# EAGLE design i2cRelay (EAGLE 9.2.2)

## Sheet 1 of 2
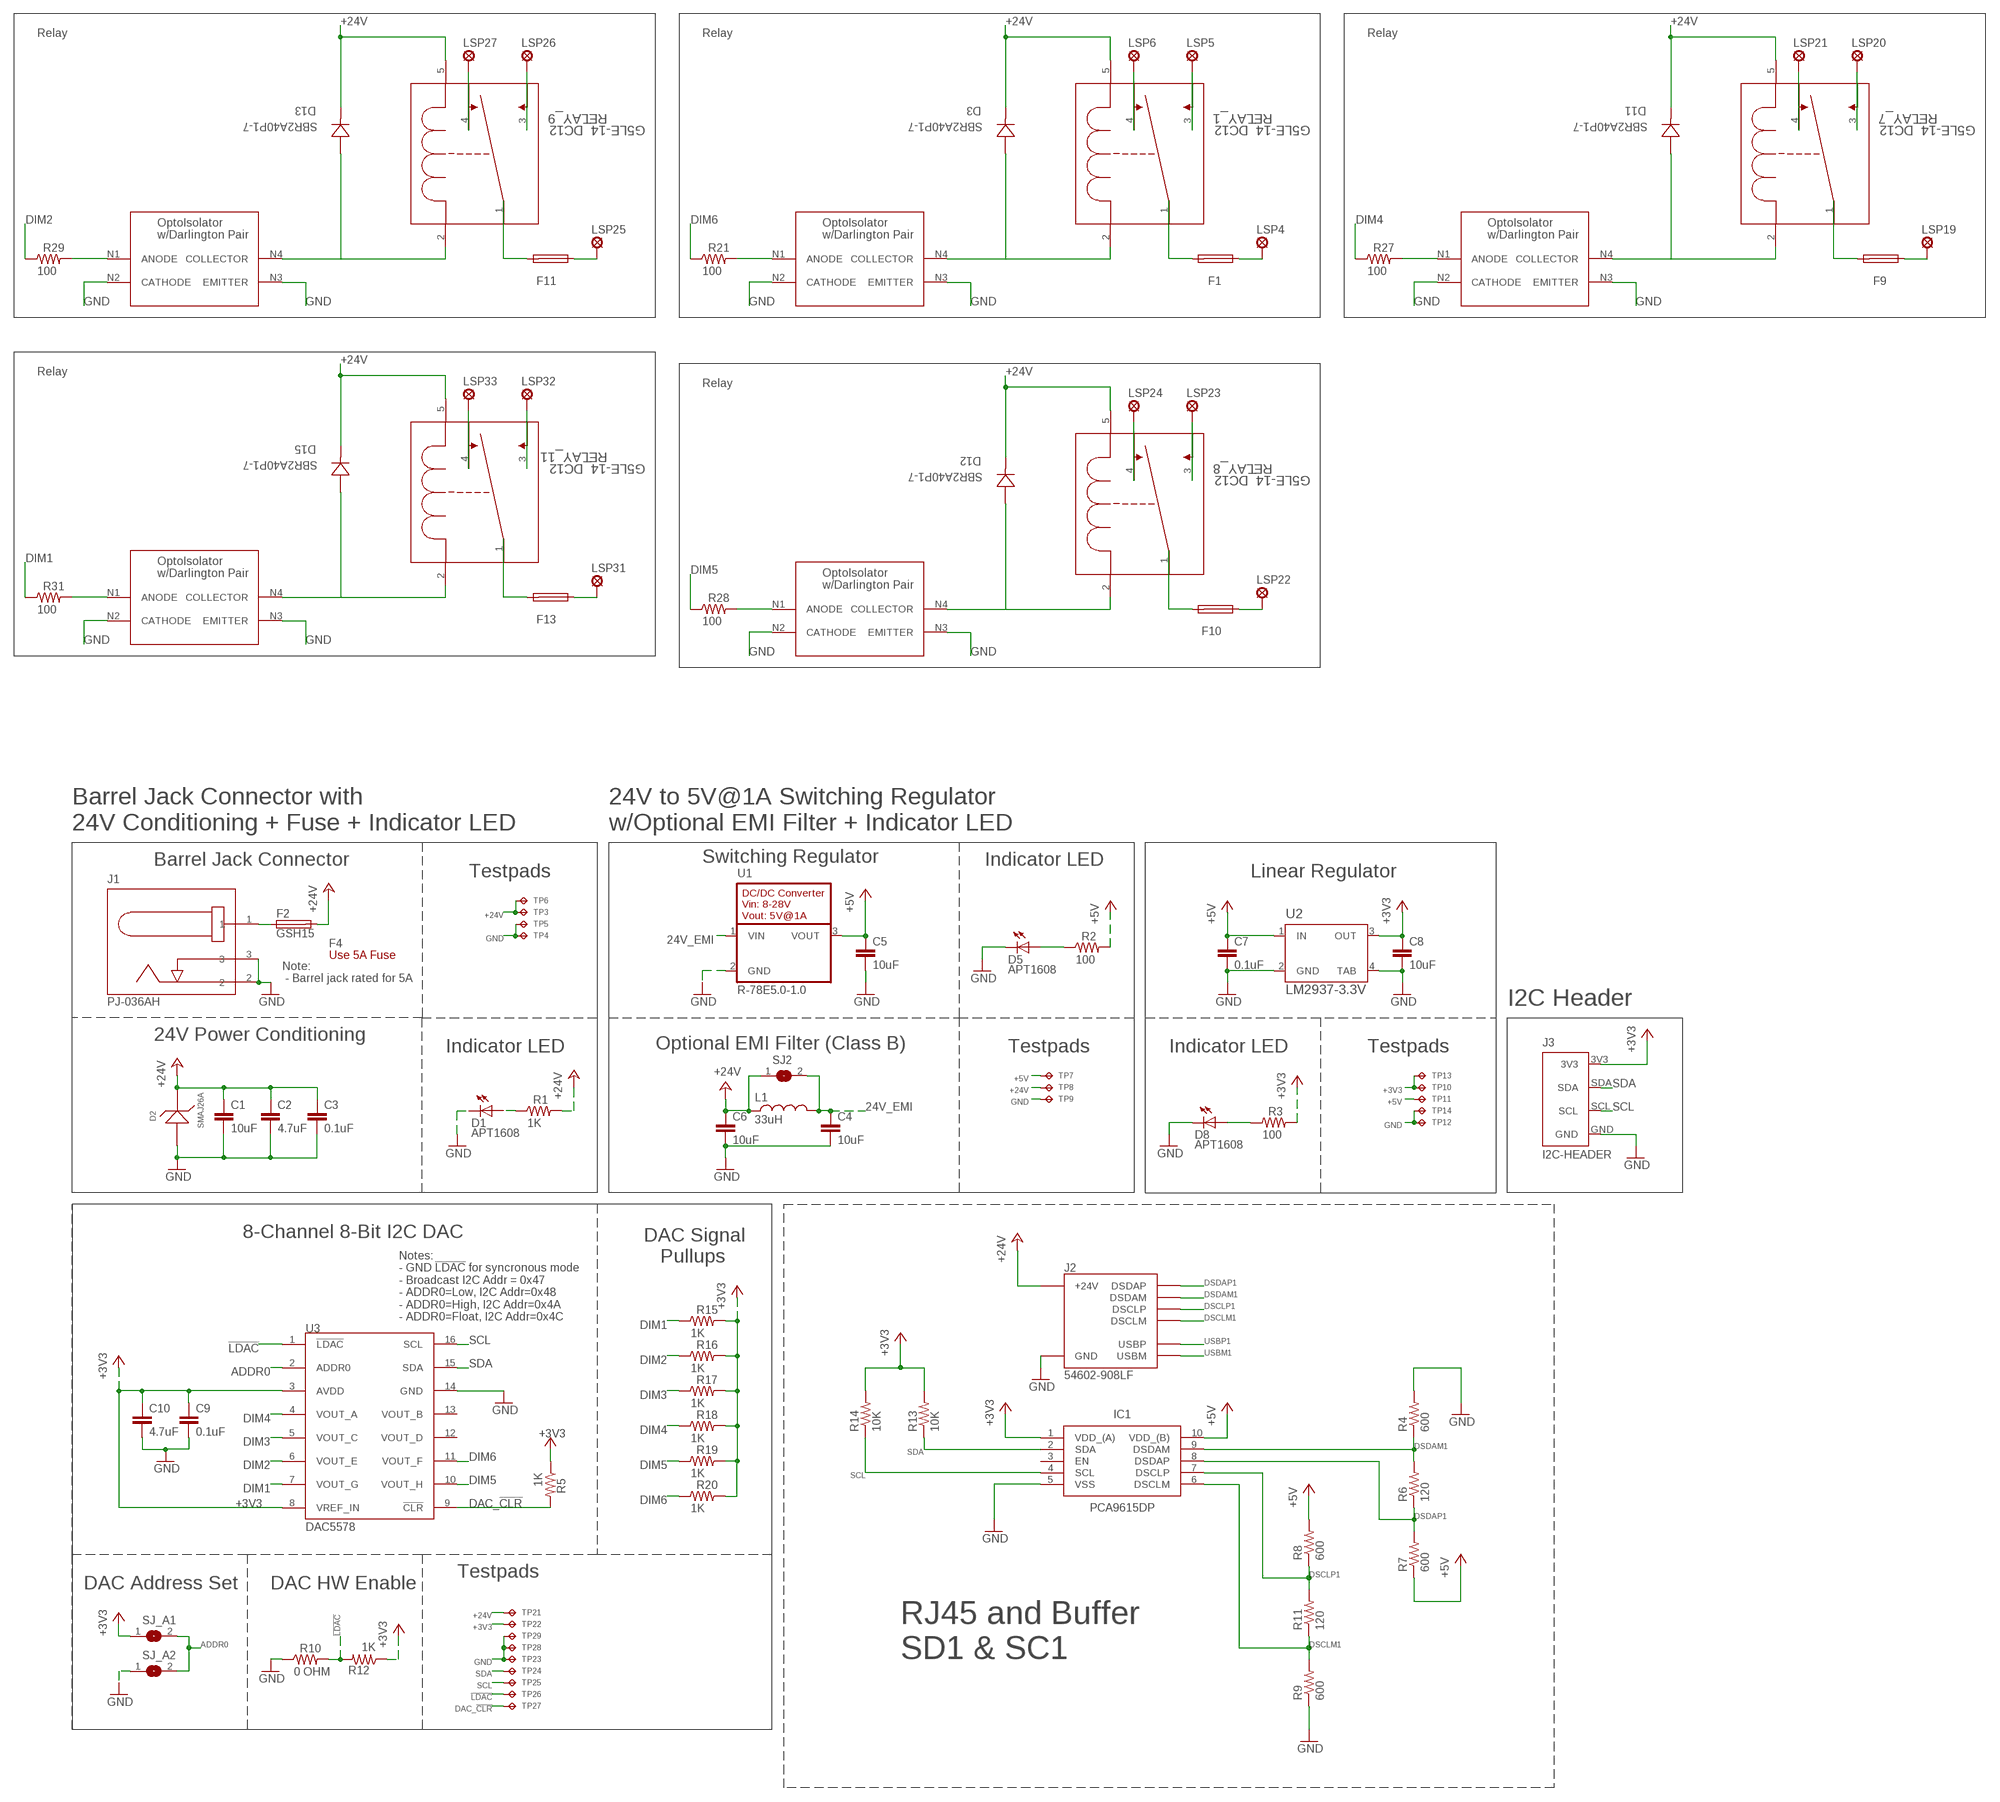
[diagram p0: schematic, sheet 1]

### Parts
C1  10uF  10UF-GMK212BBJ106KG-T  [C0805]
C2  4.7uF  4.7UF-CL21A475KBQNNNE  [C0805]
C3  0.1uF  0.1UF-C0603C104K5RACTU  [C0603]
C4  10uF  10UF-GMK212BBJ106KG-T  [C0805]
C5  10uF  10UF-GMK212BBJ106KG-T  [C0805]
C6  10uF  10UF-GMK212BBJ106KG-T  [C0805]
C7  0.1uF  0.1UF-C0603C104K5RACTU  [C0603]
C8  10uF  10UF-GMK212BBJ106KG-T  [C0805]
C9  0.1uF  0.1UF-C0603C104K5RACTU  [C0603]
C10  4.7uF  4.7UF-CL21A475KBQNNNE  [C0805]
D1  APT1608  APT1608CGCK  [CHIPLED_0603]
D2  SMAJ26A  SMAJ26A-13-F  [SMA]
D3  SBR2A40P1-7  [POWERDI123]
D5  APT1608  APT1608CGCK  [CHIPLED_0603]
D8  APT1608  APT1608CGCK  [CHIPLED_0603]
D11  SBR2A40P1-7  [POWERDI123]
D12  SBR2A40P1-7  [POWERDI123]
D13  SBR2A40P1-7  [POWERDI123]
D15  SBR2A40P1-7  [POWERDI123]
F1  GSH15  [GSH15]
F2  GSH15  [GSH15]
F4  Use 5A Fuse  0217005.MXP  [FUSE-CARTRIDGE]
F9  GSH15  [GSH15]
F10  GSH15  [GSH15]
F11  GSH15  [GSH15]
F13  GSH15  [GSH15]
IC1  PCA9615DP  [SOP50P490X110-10N]
J1  PJ-036AH  BARREL-JACK-PJ-036AH-SMT-TR  [BARREL-JACK-PJ-036AH]
J2  54602-908LF  OPENAG-V1-RJ45PTH  [OPENAG-V1-RJ45]
J3  I2C-HEADER  HEADER-I2C  [HEADER-I2C]
L1  33uH  33UH-29333C  [29333C]
LSP4  SE14  [SE14]
LSP5  SE14  [SE14]
LSP6  SE14  [SE14]
LSP19  SE14  [SE14]
LSP20  SE14  [SE14]
LSP21  SE14  [SE14]
LSP22  SE14  [SE14]
LSP23  SE14  [SE14]
LSP24  SE14  [SE14]
LSP25  SE14  [SE14]
LSP26  SE14  [SE14]
LSP27  SE14  [SE14]
LSP31  SE14  [SE14]
LSP32  SE14  [SE14]
LSP33  SE14  [SE14]
R1  1K  1K-ERJ-PB3D1001V  [RC0603N]
R2  100  100OHM-RC0603JR-07100RL  [RC0603N]
R3  100  100OHM-RC0603JR-07100RL  [RC0603N]
R4  600  R-US_R0603  [R0603]
R5  1K  1K-ERJ-PB3D1001V  [RC0603N]
R6  120  R-US_R0603  [R0603]
R7  600  R-US_R0603  [R0603]
R8  600  R-US_R0603  [R0603]
R9  600  R-US_R0603  [R0603]
R10  0 OHM  0OHM-RC0603JR-070RL  [RC0603N]
R11  120  R-US_R0603  [R0603]
R12  1K  1K-ERJ-PB3D1001V  [RC0603N]
R13  10K  R-US_R0603  [R0603]
R14  10K  R-US_R0603  [R0603]
R15  1K  1K-ERJ-PB3D1001V  [RC0603N]
R16  1K  1K-ERJ-PB3D1001V  [RC0603N]
R17  1K  1K-ERJ-PB3D1001V  [RC0603N]
R18  1K  1K-ERJ-PB3D1001V  [RC0603N]
R19  1K  1K-ERJ-PB3D1001V  [RC0603N]
R20  1K  1K-ERJ-PB3D1001V  [RC0603N]
R21  100  100OHM-RC0603JR-07100RL  [RC0603N]
R27  100  100OHM-RC0603JR-07100RL  [RC0603N]
R28  100  100OHM-RC0603JR-07100RL  [RC0603N]
R29  100  100OHM-RC0603JR-07100RL  [RC0603N]
R31  100  100OHM-RC0603JR-07100RL  [RC0603N]
RELAY_1  G5LE-14_DC12  [RELAY_G5LE-1]
RELAY_7  G5LE-14_DC12  [RELAY_G5LE-1]
RELAY_8  G5LE-14_DC12  [RELAY_G5LE-1]
RELAY_9  G5LE-14_DC12  [RELAY_G5LE-1]
RELAY_11  G5LE-14_DC12  [RELAY_G5LE-1]
SJ2  EMI-BYPASS  [EMI-BYPASS]
SJ_A1  SOLDERJUMPERREFLOW_NOPASTE  [SJ1]
SJ_A2  SOLDERJUMPERREFLOW_NOPASTE  [SJ1]
TP3  TPTP04R  [TP04R]
TP4  TPTP04R  [TP04R]
TP5  TPTP04R  [TP04R]
TP6  TPTP04R  [TP04R]
TP7  TPTP06R  [TP06R]
TP8  TPTP06R  [TP06R]
TP9  TPTP06R  [TP06R]
TP10  TPTP04R  [TP04R]
TP11  TPTP04R  [TP04R]
TP12  TPTP04R  [TP04R]
TP13  TPTP04R  [TP04R]
TP14  TPTP04R  [TP04R]
TP21  TPTP04R  [TP04R]
TP22  TPTP04R  [TP04R]
TP23  TPTP04R  [TP04R]
TP24  TPTP04R  [TP04R]
TP25  TPTP04R  [TP04R]
TP26  TPTP04R  [TP04R]
TP27  TPTP04R  [TP04R]
TP28  TPTP04R  [TP04R]
TP29  TPTP04R  [TP04R]
U1  R-78E5.0-1.0  [R-78E5.0-1.0]
U2  LM2937-3.3V  LM2937IMP-3.3/NOPB  [MP04A]
U3  DAC5578  DAC5578SPW  [TSSOP16]
U$3  LTV-355T  [LTV-355T]
U$8  LTV-355T  [LTV-355T]
U$9  LTV-355T  [LTV-355T]
U$10  LTV-355T  [LTV-355T]
U$12  LTV-355T  [LTV-355T]

### Nets
24V_EMI: C4.1 L1.2 SJ2.2 U1.1(VIN)
24V_IN1: F2.1 J1.1
!LDAC!: R10.2 R12.2 TP26.1(TP) U3.1(!LDAC!)
+3V3: C8.1 C9.1 C10.1 IC1.1(VDD_(A)) J3.3V3 R3.2 R5.1 R12.1 R13.2 R14.2 R15.2 R16.2 R17.2 R18.2 R19.2 R20.2 SJ_A1.1 TP10.1(TP) TP13.1(TP) TP22.1(TP) U2.3(OUT) U3.3(AVDD) U3.8(VREF_IN)
+5V: C5.1 C7.1 IC1.10(VDD_(B)) R2.2 R7.1 R8.2 TP7.TP TP11.1(TP) U1.3(VOUT) U2.1(IN)
+24V: C1.1 C2.1 C3.1 C6.1 D2.1 D3.- D11.- D12.- D13.- D15.- F2.2 J2.24V(6)(+24V) L1.1 R1.2 RELAY_1.5 RELAY_7.5 RELAY_8.5 RELAY_9.5 RELAY_11.5 SJ2.1 TP3.1(TP) TP6.1(TP) TP8.TP TP21.1(TP) ; also sheet 2
ADDR0: SJ_A1.2 SJ_A2.2 U3.2(ADDR0)
DAC_!CLR!: R5.2 TP27.1(TP) U3.9(!CLR!)
DIM1: R15.1 R31.1 U3.7(VOUT_G)
DIM2: R16.1 R29.1 U3.6(VOUT_E)
DIM3: R17.1 U3.5(VOUT_C) ; also sheet 2
DIM4: R18.1 R27.1 U3.4(VOUT_A)
DIM5: R19.1 R28.1 U3.10(VOUT_H)
DIM6: R20.1 R21.1 U3.11(VOUT_F)
DSCLM1: IC1.6(DSCLM) J2.DSCLM(5)(DSCLM) R9.2 R11.1
DSCLP1: IC1.7(DSCLP) J2.DSCLP(4)(DSCLP) R8.1 R11.2
DSDAM1: IC1.9(DSDAM) J2.DSDAM(2)(DSDAM) R4.1 R6.2
DSDAP1: IC1.8(DSDAP) J2.DSDAP(1)(DSDAP) R6.1 R7.2
GND: C1.2 C2.2 C3.2 C4.2 C5.2 C6.2 C7.2 C8.2 C9.2 C10.2 D1.C D2.2 D5.C D8.C IC1.5(VSS) J1.2 J1.3 J2.GND(3)(GND) J3.GND R4.2 R9.1 R10.1 SJ_A2.1 TP4.1(TP) TP5.1(TP) TP9.TP TP12.1(TP) TP14.1(TP) TP23.1(TP) TP28.1(TP) TP29.1(TP) U1.2(GND) U2.2(GND) U2.4(TAB) U3.14(GND) U$3.N2(CATHODE) U$3.N3(EMITTER) U$8.N2(CATHODE) U$8.N3(EMITTER) U$9.N2(CATHODE) U$9.N3(EMITTER) U$10.N2(CATHODE) U$10.N3(EMITTER) U$12.N2(CATHODE) U$12.N3(EMITTER) ; also sheet 2
N$1: D1.A R1.1
N$3: D5.A R2.1
N$5: D3.+ RELAY_1.2 U$3.N4(COLLECTOR)
N$6: D8.A R3.1
N$7: F1.2 RELAY_1.1
N$11: LSP5.MP RELAY_1.3
N$13: R21.2 U$3.N1(ANODE)
N$14: LSP6.MP RELAY_1.4
N$15: F1.1 LSP4.MP
N$40: D11.+ RELAY_7.2 U$8.N4(COLLECTOR)
N$41: F9.2 RELAY_7.1
N$42: LSP20.MP RELAY_7.3
N$43: R27.2 U$8.N1(ANODE)
N$44: LSP21.MP RELAY_7.4
N$45: F9.1 LSP19.MP
N$46: D12.+ RELAY_8.2 U$9.N4(COLLECTOR)
N$47: F10.2 RELAY_8.1
N$48: LSP23.MP RELAY_8.3
N$49: R28.2 U$9.N1(ANODE)
N$50: LSP24.MP RELAY_8.4
N$51: F10.1 LSP22.MP
N$52: D13.+ RELAY_9.2 U$10.N4(COLLECTOR)
N$53: F11.2 RELAY_9.1
N$54: LSP26.MP RELAY_9.3
N$55: R29.2 U$10.N1(ANODE)
N$56: LSP27.MP RELAY_9.4
N$57: F11.1 LSP25.MP
N$64: D15.+ RELAY_11.2 U$12.N4(COLLECTOR)
N$65: F13.2 RELAY_11.1
N$66: LSP32.MP RELAY_11.3
N$67: R31.2 U$12.N1(ANODE)
N$68: LSP33.MP RELAY_11.4
N$69: F13.1 LSP31.MP
SCL: IC1.4(SCL) J3.SCL R14.1 TP25.1(TP) U3.16(SCL)
SDA: IC1.2(SDA) J3.SDA R13.1 TP24.1(TP) U3.15(SDA)
USBM1: J2.USBM(8)(USBM)
USBP1: J2.USBP(7)(USBP)
Unconnected: IC1.3(EN) U3.12(VOUT_D) U3.13(VOUT_B)

### Notes on the sheet
- Relay | Relay | Relay
- Relay
- Relay
- Barrel Jack Connector with
  24V Conditioning + Fuse + Indicator LED
- 24V to 5V@1A Switching Regulator
  w/Optional EMI Filter + Indicator LED
- Barrel Jack Connector | Switching Regulator | Indicator LED
- Testpads | Linear Regulator
- Note:
   - Barrel jack rated for 5A
- I2C Header
- 24V Power Conditioning
- Indicator LED | Optional EMI Filter (Class B) | Testpads | Indicator LED | Testpads
- 8-Channel 8-Bit I2C DAC
- DAC Signal 
     Pullups
- Notes:
  - GND !LDAC! for syncronous mode
  - Broadcast I2C Addr = 0x47
  - ADDR0=Low, I2C Addr=0x48
  - ADDR0=High, I2C Addr=0x4A
  - ADDR0=Float, I2C Addr=0x4C
- Testpads
- DAC Address Set | DAC HW Enable
- RJ45 and Buffer
  SD1 & SC1

## Sheet 2 of 2
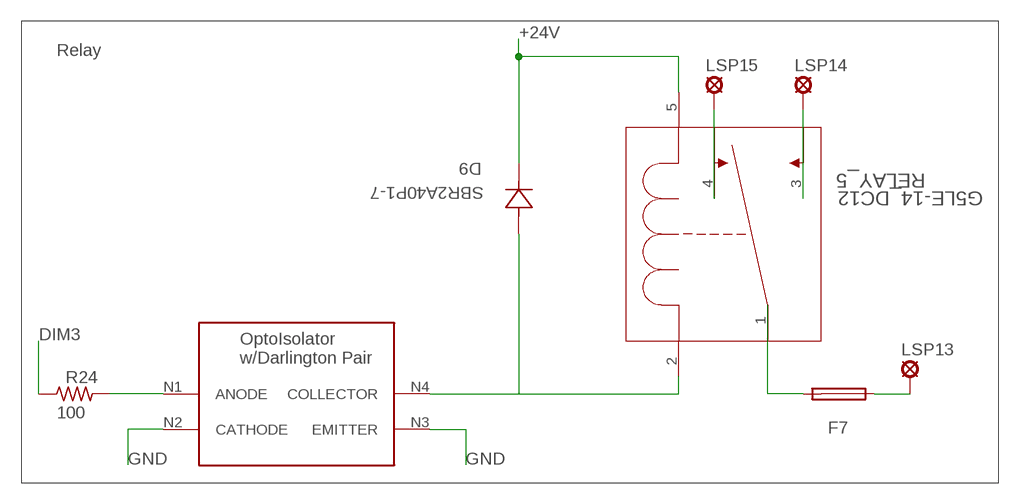
[diagram p1: schematic, sheet 2]

### Parts
D9  SBR2A40P1-7  [POWERDI123]
F7  GSH15  [GSH15]
LSP13  SE14  [SE14]
LSP14  SE14  [SE14]
LSP15  SE14  [SE14]
R24  100  100OHM-RC0603JR-07100RL  [RC0603N]
RELAY_5  G5LE-14_DC12  [RELAY_G5LE-1]
U$6  LTV-355T  [LTV-355T]

### Nets
+24V: D9.- RELAY_5.5 ; also sheet 1
DIM3: R24.1 ; also sheet 1
GND: U$6.N2(CATHODE) U$6.N3(EMITTER) ; also sheet 1
N$28: D9.+ RELAY_5.2 U$6.N4(COLLECTOR)
N$29: F7.2 RELAY_5.1
N$30: LSP14.MP RELAY_5.3
N$31: R24.2 U$6.N1(ANODE)
N$32: LSP15.MP RELAY_5.4
N$33: F7.1 LSP13.MP

### Notes on the sheet
- Relay

## Library data of the parts
C1 C4-C6 C8 = openag-capacitors:10UF-GMK212BBJ106KG-T: CAP CER 10UF 35V X5R 0805 Description: 10µF ±10% 35V Ceramic Capacitor X5R 0805 (2012 Metric) Technical Specifications: Capacitance: 10µF Tolerance: ±10% Rated Voltage: 35V Temperature Coefficient: X5R Operating Temperature: -55°C ~ 85°C Package / Case: 0805 (2012 Metric) Datasheet(s): GMK212BBJ106KG-T Spec <http://ds.yuden.co.jp/TYCOMPAS/ut/detail.do?productNo=GMK212BBJ106KG-T&fileName=GMK212BBJ106KG-T_SS&mode=specSheetDownload> Vendor(s): Digikey: 587-4893-1-ND <https://www.digikey.com/product-detail/en/taiyo-yuden/GMK212BBJ106KG-T/587-4893-1-ND/6563736>; MANUFACTURER: Taiyo Yuden; MPN: GMK212BBJ106KG-T; VENDOR: Digikey; VLINK: https://www.digikey.com/product-detail/en/taiyo-yuden/GMK212BBJ106KG-T/587-4893-1-ND/6563736; VPN: 587-4893-1-ND
C2 C10 = openag-capacitors:4.7UF-CL21A475KBQNNNE: CAP CER 4.7UF 50V X5R 0805 Description: 4.7µF ±10% 50V Ceramic Capacitor X5R 0805 (2012 Metric) Technical Specifications: Capacitance: 4.7uF Tolerance: ±10% Rated Voltage: 50V Temperature Coefficient: X5R Operating Temperature: -55°C ~ 85°C Package/Case: 0805 (2012 Metric) Datasheet(s): CL21A475KBQNNNE Characteristics <http://www.samsungsem.com/kr/front/downloadcms.do?path=/kr/support/product-search/mlcc/__icsFiles/afieldfile/2014/11/05&fileName=C_CL21A475KBQNNNE.pdf> Vendor(s): Digikey: 1276-1248-1-ND <https://www.digikey.com/product-detail/en/samsung-electro-mechanics/CL21A475KBQNNNE/1276-1248-1-ND/3889334>; MANUFACTURER: Samsung; MPN: CL21A475KBQNNNE; VENDOR: Digikey; VLINK: https://www.digikey.com/product-detail/en/samsung-electro-mechanics/CL21A475KBQNNNE/1276-1248-1-ND/3889334; VPN: 1276-1248-1-ND
C3 C7 C9 = openag-capacitors:0.1UF-C0603C104K5RACTU: CAP CER 0.1UF 50V X7R 0603 Description: 0.1µF ±10% 50V Ceramic Capacitor X7R 0603 (1608 Metric) Technical Specifications: Capacitance: 0.1µF Tolerance: ±10% Rated Voltage: 50V Temperature Coefficient: X7R Operating Temperature: -55°C ~ 125°C Package / Case: 0603 (1608 Metric) Datasheet(s): X7R Dielectric, 6.3-250 VDC <https://search.kemet.com/component-edge/download/datasheet/C0603C104K5RACTU.pdf> Vendor(s): Digikey: 399-5089-1-ND <https://www.digikey.com/product-detail/en/kemet/C0603C104K5RACTU/399-5089-1-ND/1465623>; MANUFACTURER: Kemet; MPN: C0603C104K5RACTU; VENDOR: Digikey; VLINK: https://www.digikey.com/product-detail/en/kemet/C0603C104K5RACTU/399-5089-1-ND/1465623; VPN: 399-5089-1-ND
D1 D5 D8 = openag-diodes:APT1608CGCK: LED GREEN CLEAR 0603 SMD Description: Green 570nm LED Indication - Discrete 2.1V 0603 (1608 Metric) Technical Specifications: Color: Green Lens Color: Colorless Lens Transparency: Clear Millicandela Rating: 50mcd Lens Style/Size: Rectangle with Flat Top, 1.20mm x 0.80mm Voltage - Forward (Vf) (Typ): 2.1V Current - Test: 20mA Viewing Angle: 120° Mounting Type: Surface Mount Wavelength - Dominant: 570nm Wavelength - Peak: 574nm Package / Case: 0603 (1608 Metric) Supplier Device Package: Chip LED Size / Dimension: 1.60mm L x 0.80mm W Height (Max): 0.75mm Datasheet(s): APT1608CGCK <http://www.kingbrightusa.com/images/catalog/SPEC/APT1608CGCK.pdf> Vendor(s): Digikey: 754-1116-1-ND <https://www.digikey.com/product-detail/en/kingbright/APT1608CGCK/754-1116-1-ND/1747833#>; MANUFACTURER: Kingbright; MPN: APT1608CGCK; VENDOR: Digikey; VLINK: https://www.digikey.com/product-detail/en/kingbright/APT1608CGCK/754-1116-1-ND/1747833#; VPN: 754-1116-1-ND
D2 = openag-diodes:SMAJ26A-13-F: TVS DIODE 26VWM 42.1VC SMA Description: TVS DIODE 26VWM 42.1VC SMA Technical Specifications: Type: Zener Voltage - Reverse Standoff (Typ): 26V Voltage - Breakdown (Min): 28.9V Voltage - Clamping (Max) @ Ipp: 42.1V Current - Peak Pulse (10/1000µs): 9.5A Power - Peak Pulse: 400W Power Line Protection: No Operating Temperature: -55°C ~ 150°C (TJ) DO-214AC, SMA Datasheet(s): SMAJ5.0(C)A - SMAJ200(C)A Vendor(s): Digikey: SMAJ26A-FDICT-ND <https://www.digikey.com/product-detail/en/diodes-incorporated/SMAJ26A-13-F/SMAJ26A-FDICT-ND/806583>; MANUFACTURER: Diodes Incorporated; MPN: SMAJ26A-13-F; VENDOR: Digikey; VLINK: https://www.digikey.com/product-detail/en/diodes-incorporated/SMAJ26A-13-F/SMAJ26A-FDICT-ND/806583; VPN: SMAJ26A-FDICT-ND
D3 D9 D11-D13 D15 = openag-diodes:SBR2A40P1-7: DIODE SBR 40V 2A POWERDI123 Description: Diode Super Barrier 40V 2A Surface Mount PowerDI™ 123 Technical Specifications: Diode Type: Super Barrier Voltage - DC Reverse (Vr) (Max): 40V Current - Average Rectified (Io): 2A Voltage - Forward (Vf) (Max) @ If: 500mV @ 2A Speed: Standard Recovery >500ns, > 200mA (Io) Current - Reverse Leakage @ Vr: 100µA @ 40V Mounting Type: Surface Mount Package / Case: POWERDI®123 Supplier Device Package: PowerDI™ 123 Operating Temperature - Junction: -65°C ~ 150°C Base Part Number: SBR2A40 Datasheet(s): SBR2A40P1 <https://www.diodes.com/assets/Datasheets/SBR2A40P1.pdf> Vendor(s): Digikey: SBR2A40P1DITR-ND <https://www.digikey.com/product-detail/en/diodes-incorporated/SBR2A40P1-7/SBR2A40P1DITR-ND/1681825>; MANUFACTURER: Diodes Incorporated; MPN: SBR2A40P1-7; VENDOR: Digikey; VLINK: https://www.digikey.com/product-detail/en/diodes-incorporated/SBR2A40P1-7/SBR2A40P1DITR-ND/1681825; VPN: SBR2A40P1DITR-ND
F1 F7 F9-F11 F13 = fuse:GSH15: FUSE HOLDER grid 15mm, 19649 Wickmann; MPN: 64900001039; OC_FARNELL: 1271673; OC_NEWARK: 02P0318
F2 = openag-fuses:GSH15: FUSE BLOCK CART 250V 6.3A PCB Description: Fuse Block 6.3A 250V 1 Circuit Cartridge PCB Technical Specifications: Fuseholder Type: Block Fuse Type: Cartridge For Use With/Related Products: 5mm x 20mm Fuse Size: 5mm x 20mm Number of Circuits: 1 Voltage: 250V Current Rating: 6.3A Mounting Type: PCB Orientation: Horizontal Termination Style: PC Pin Contact Material: Copper Alloy Contact Finish: Tin Datasheet(s): 649 Series <http://www.littelfuse.com/~/media/electronics/datasheets/fuse_blocks/littelfuse_fuse_block_649_datasheet.pdf.pdf> Vendor(s): Digikey: WK0011-ND <https://www.digikey.com/product-detail/en/littelfuse-inc/64900001039/WK0011-ND/245470>; MANUFACTURER: Littelfuse Inc.; MPN: 64900001039; VENDOR: Digikey; VLINK: https://www.digikey.com/product-detail/en/littelfuse-inc/64900001039/WK0011-ND/245470; VPN: WK0011-ND
F4 = openag-fuses:0217005.MXP: FUSE GLASS 5A 250VAC 5X20MM Description: FUSE GLASS 5A 250VAC 5X20MM Technical Specifications: Fuse Type: Cartridge, Glass Current Rating: 5A Voltage Rating - AC: 250V Response Time: Fast Package / Case: 5mm x 20mm Mounting Type: Holder Breaking Capacity @ Rated Voltage: 50A Melting I²t: 42.795 Approvals: BSI, CE, CCC, CSA, KC, PSE, SEMKO, UR, VDE Operating Temperature: -55°C ~ 125°C Size / Dimension: 0.205" Dia x 0.787" L (5.20mm x 20.00mm) DC Cold Resistance: 0.0137 Ohms Datasheet(s): 217 Series Datasheet <http://www.littelfuse.com/~/media/electronics/datasheets/fuses/littelfuse_fuse_217_datasheet.pdf.pdf> Vendor(s): Digikey: F1725-ND <https://www.digikey.com/product-detail/en/littelfuse-inc/0217005.MXP/F1725-ND/777549#>; MANUFACTURER: Littelfuse Inc.; MPN: 0217005.MXP; VENDOR: Digikey; VLINK: https://www.digikey.com/product-detail/en/littelfuse-inc/0217005.MXP/F1725-ND/777549; VPN: F1725-ND
IC1 = PCA9615DP:PCA9615DP: Buffer, ReDriver 2 Channel 400kHz 10-TSSOP Source: Datasheet <http://www.nxp.com/docs/en/data-sheet/PCA9615.pdf>; DESCRIPTION: Buffer, ReDriver 2 Channel 400kHz 10-TSSOP; HEIGHT: 1.1mm; MANUFACTURER_NAME: Nexperia; MANUFACTURER_PART_NUMBER: PCA9615DP; SUPPLIER_NAME: RS
J1 = openag-connectors:BARREL-JACK-PJ-036AH-SMT-TR: CONN PWR JACK 2X5.5MM SOLDER Description: Power Barrel Connector Jack 2.10mm ID (0.083"), 5.50mm OD (0.217") Surface Mount, Right Angle Technical Specifications: Connector Type: Jack Gender: Male Industry Recognized Mating Diameter: 2.10mm ID (0.083"), 5.50mm OD (0.217") Actual Diameter: 0.078" (2.00mm ID), 0.248" (6.30mm OD) Number of Positions/Contacts: 2 Conductors, 3 Contacts Internal Switch(s): Single Switch, Normally Closed Mounting Type: Surface Mount, Right Angle Termination: Solder Shielding: Unshielded Voltage - Rated: 24VDC Current Rating: 5A Mating Length/Depth: 0.360" (9.15mm) Contact Material - Plating: Silver Operating Temperature: -25°C ~ 85°C Housing Material: Polyamide (PA6T), Nylon 6T Contact Material: Brass; Copper Alloy Body Color: Black Datasheet(s): PJ-036AH-SMT-TR <http://www.cui.com/product/resource/digikeypdf/pj-036ah-smt-tr.pdf> Vendor(s): Digikey: CP-036AHPJCT-ND <https://www.digikey.com/product-detail/en/cui-inc/PJ-036AH-SMT-TR/CP-036AHPJCT-ND/1530994>; MANUFACTURER: CUI Inc.; MPN: PJ-036AH-SMT-TR; VENDOR: Digikey; VLINK: https://www.digikey.com/product-detail/en/cui-inc/PJ-036AH-SMT-TR/CP-036AHPJCT-ND/1530994; VPN: CP-036AHPJCT-ND
J2 = openag_connector:OPENAG-V1-RJ45: Amphenol FCI - 54602-908LF - CONN MOD JACK 8P8C R/A UNSHLD Description: Jack Modular Connector 8p8c (RJ45, Ethernet) 90� Angle (Right) Unshielded Cat3 Technical Specifications: Connector Type: Jack Number of Positions/Contacts: 8p8c (RJ45, Ethernet) Number of Ports: 1 Number of Rows: 1 Mounting Type: Through Hole Orientation: 90� Angle (Right) Termination: Solder Shielding: Unshielded Ratings: Cat3 Features: Board Lock LED Color: Does Not Contain LED Tab Direction: Down Contact Material: Copper Alloy Contact Finish: Gold Contact Finish Thickness: 15�in (0.38�m) Housing Material: Polyester, Glass Filled Operating Temperature: -40�C ~ 70�C Datasheet(s): 54601-x04(zzz)WPLF Drawing <http://cdn.amphenol-icc.com/media/wysiwyg/files/drawing/c-bmj-0102.pdf> Vendor(s): Digikey: 609-1046-ND <https://www.digikey.com/product-detail/en/amphenol-fci/54602-908LF/609-1046-ND/1001360>; POPULATE: YES; VERIFIED: NO
J3 = openag-connectors:HEADER-I2C: 100 MIL HEADER I2C CONNECTIONS; MPN: N/A
L1 = openag-inductors:33UH-29333C: FIXED IND 33UH 1A 120 MOHM SMD Description: 33µH Shielded Wirewound Inductor 1A 120 mOhm Max Nonstandard Technical Specifications: Type: Wirewound Inductance: 33µH Current Rating: 1A Shielding: Shielded DC Resistance (DCR): 120 mOhm Max Operating Temperature: -40°C ~ 85°C Frequency - Test: 10kHz Mounting Type: Surface Mount Package / Case: Nonstandard Size / Dimension: 0.283" L x 0.283" W (7.20mm x 7.20mm) Height - Seated (Max): 0.157" (4.00mm) Datasheet(s): 2900 Series <https://www.murata-ps.com/data/magnetics/kmp_2900.pdf> Vendor(s): Digikey: 811-1138-1-ND <https://www.digikey.com/product-detail/en/murata-power-solutions-inc/29333C/811-1138-1-ND/1924860>; MANUFACTURER: Murata Power Solutions Inc.; MPN: 29333C; VENDOR: Digikey; VLINK: https://www.digikey.com/product-detail/en/murata-power-solutions-inc/29333C/811-1138-1-ND/1924860; VPN: 811-1138-1-ND
LSP4-LSP6 LSP13-LSP15 LSP19-LSP27 LSP31-LSP33 = solpad:SE14: SOLDER PAD E1553, drill 1,4mm, distributor Buerklin, 07F820
R1 R5 R12 R15-R20 = openag-resistors:1K-ERJ-PB3D1001V: RES SMD 1K OHM 0.5% 1/5W 0603 Description: 1 kOhms ±0.5% 0.2W, 1/5W Chip Resistor 0603 (1608 Metric) Automotive AEC-Q200, Pulse Withstanding Thick Film Technical Specifications: Resistance: 1 kOhms Tolerance: ±0.5% Power: 0.2W, 1/5W Operating Temperature: -55°C ~ 155°C Package / Case: 0603 (1608 Metric) Datasheet(s): ERJ-PB3, PB6 Series, High Precision Datasheet <https://industrial.panasonic.com/cdbs/www-data/pdf/RDM0000/AOA0000C328.pdf> Vendor(s): Digikey: P20283CT-ND <https://www.digikey.com/product-detail/en/panasonic-electronic-components/ERJ-PB3D1001V/P20283CT-ND/6214538>; MANUFACTURER: Panasonic; MPN: P20283CT-ND; VENDOR: Digikey; VLINK: https://www.digikey.com/product-detail/en/panasonic-electronic-components/ERJ-PB3D1001V/P20283CT-ND/6214538; VPN: P20283CT-ND
R2 R3 R21 R24 R27-R29 R31 = openag-resistors:100OHM-RC0603JR-07100RL: RES SMD 100 OHM 5% 1/10W 0603 Description: 100 Ohms ±5% 0.1W, 1/10W Chip Resistor 0603 (1608 Metric) Moisture Resistant Thick Film Technical Specifications: Resistance: 100 Ohms Tolerance: ±5% Power (Watts): 0.1W, 1/10W Composition: Thick Film Features: Moisture Resistant Temperature Coefficient: ±100ppm/°C Operating Temperature: -55°C ~ 155°C Package / Case: 0603 (1608 Metric) Supplier Device Package: 0603 Size / Dimension: 0.063" L x 0.032" W (1.60mm x 0.80mm) Height - Seated (Max): 0.022" (0.55mm) Number of Terminations: 2 Datasheet(s): Thick Film Chip Resistor Intro <http://www.yageo.com.tw/exep/pages/download/literatures/PYu-R_INT-thick_7.pdf> Chip Resistor Marking <http://www.yageo.com/exep/pages/download/literatures/PYu-R_Marking_2.pdf> RC Series, L Datasheet <http://www.yageo.com/documents/recent/PYu-RC_Group_51_RoHS_L_8.pdf> Vendor(s): Digikey: 311-100GRCT-ND <https://www.digikey.com/product-detail/en/yageo/RC0603JR-07100RL/311-100GRCT-ND/729644>; MANUFACTURER: Yageo; MPN: RC0603JR-07100RL; VENDOR: Digikey; VLINK: https://www.digikey.com/product-detail/en/yageo/RC0603JR-07100RL/311-100GRCT-ND/729644; VPN: 311-100GRCT-ND
R4 R6-R9 R11 R13 R14 = rcl:R-US_: RESISTOR, American symbol
R10 = openag-resistors:0OHM-RC0603JR-070RL: RES SMD 0 OHM JUMPER 1/10W 0603 Description: 0 Ohms Jumper 0.1W, 1/10W Chip Resistor 0603 (1608 Metric) Moisture Resistant Thick Film Technical Specifications: Resistance: 0 Ohms Power: 0.1W, 1/10W Operating Temperature: -55°C ~ 155°C Package / Case: 0603 (1608 Metric) Datasheet(s): RC Series, L Datasheet <http://www.yageo.com/documents/recent/PYu-RC_Group_51_RoHS_L_8.pdf> Vendor(s): Digikey: 311-0.0GRCT-ND <https://www.digikey.com/product-detail/en/yageo/RC0603JR-070RL/311-0.0GRCT-ND/729622>; MANUFACTURER: Yageo; MPN: RC0603JR-070RL; VENDOR: Digikey; VLINK: https://www.digikey.com/product-detail/en/yageo/RC0603JR-070RL/311-0.0GRCT-ND/729622; VPN: 311-0.0GRCT-ND
RELAY_1 RELAY_5 RELAY_7-RELAY_9 RELAY_11 = relay_2:G5LE-14_DC12; MANUFACTURER_PART_NUMBER: G5LE14 DC12; VENDOR: OMRON
SJ2 = openag-connectors:EMI-BYPASS: EMI Bypass Solder Jumper; MPN: N/A
SJ_A1 SJ_A2 = openag-connectors:SOLDERJUMPER: SMD Solder JUMPER Solder the two pads together to create a connection, or remove the solder to break it. REFLOW - Use this footprint for solder paste and reflow ovens. WAVE - Use this footprint for hand-soldering (larger pads). CLOSED - Has a trace between the two pads to ensure it is closed by default. The trace needs to be cut to disable the jumper, and can be closed again by creating a solder bridge between the two pads.; MPN: N/A
TP3-TP14 TP21-TP29 = openag-testpads:TP: Test pad; MPN: N/A
U1 = openag-regulators:R-78E5.0-1.0: DC/DC CONVERTER 5V 5W Description: Linear Regulator Replacement DC DC Converter 1 Output 5V 1A 8V - 28V Input Technical Specifications: Type: Linear Regulator Replacement Number of Outputs: 1 Voltage - Input (Min): 8V Voltage - Input (Max): 28V Voltage - Output 1: 5V Current - Output (Max): 1A Power (Watts): 5W Applications: ITE (Commercial) Features: SCP Operating Temperature: -40°C ~ 85°C Efficiency: 91% Mounting Type: Through Hole Package / Case: 3-SIP Module Size / Dimension: 0.46" L x 0.33" W x 0.41" H (11.6mm x 8.5mm x 10.4mm) Datasheet(s): R-78E-1.0 Series Datasheet <https://www.recom-power.com/pdf/Innoline/R-78Exx-1.0.pdf> Vendor(s): Digikey: 945-2201-ND <https://www.digikey.com/product-detail/en/recom-power/R-78E5.0-1.0/945-2201-ND/4930585>; MANUFACTURER: Recom Power; MPN: R-78E5.0-1.0; VENDOR: Digikey; VLINK: https://www.digikey.com/product-detail/en/recom-power/R-78E5.0-1.0/945-2201-ND/4930585; VPN: 945-2201-ND
U2 = openag-regulators:LM2937IMP-3.3/NOPB: IC REG LIN 3.3V 400MA SOT223-4 Description: Linear Voltage Regulator IC Positive Fixed 1 Output 3.3V 400mA SOT-223-4 Technical Specifications: Output Configuration: Positive Output Type: Fixed Number of Regulators: 1 Voltage - Input (Max): 26V Voltage - Output (Min/Fixed): 3.3V Voltage Dropout (Max): 1V @ 50mA Current - Output: 400mA Current - Quiescent (Iq): 2mA Current - Supply (Max): 1.25A Protection Features: Over Temperature, Reverse Polarity, Short Circuit Operating Temperature: -40°C ~ 85°C Mounting Type: Surface Mount Package / Case: TO-261-4, TO-261AA Supplier Device Package: SOT-223-4 Base Part Number: LM2937 Datasheet(s): LM2937-2.5, LM2937-3.3 Datasheet <http://www.ti.com/lit/ds/symlink/lm2937-2.5.pdf> Vendor(s): Digikey: LM2937IMP-3.3/NOPBCT-ND <https://www.digikey.com/product-detail/en/texas-instruments/LM2937IMP-3.3-NOPB/LM2937IMP-3.3-NOPBCT-ND/270742#>; MANUFACTURER: Texas Instruments; MPN: LM2937IMP-3.3/NOPB; VENDOR: Digikey; VLINK: https://www.digikey.com/product-detail/en/texas-instruments/LM2937IMP-3.3-NOPB/LM2937IMP-3.3-NOPBCT-ND/270742#; VPN: LM2937IMP-3.3/NOPBCT-ND
U3 = openag-dacs:DAC5578SPW: IC DAC 8BIT I2C OCTAL 16TSSOP Description: 8 Bit Digital to Analog Converter 8 16-TSSOP Technical Specifications: Number of Bits: 8 Number of D/A Converters: 8 Settling Time: 12µs (Typ) Output Type: Voltage - Buffered Differential Output: No Data Interface: I²C Reference Type: External Voltage - Supply, Analog: 2.7 V ~ 5.5 V Voltage - Supply, Digital: 2.7 V ~ 5.5 V INL/DNL (LSB): ±0.01, ±0.01 Architecture: String DAC Operating Temperature: -40°C ~ 125°C Package / Case: 16-TSSOP (0.173", 4.40mm Width) Supplier Device Package: 16-TSSOP Base Part Number: DAC5578 Datasheet(s): DAC5578,6578,7578 <http://www.ti.com/lit/ds/symlink/dac5578.pdf> Analog Signal Chain Guide <http://www.ti.com/lit/pdf/slyb174> Vendor(s): Digikey: 296-27736-5-ND <https://www.digikey.com/product-detail/en/texas-instruments/DAC5578SPW/296-27736-5-ND/2360827>; MANUFACTURER: Texas Instruments; MPN: DAC5578SPW; VENDOR: Digikey; VLINK: https://www.digikey.com/product-detail/en/texas-instruments/DAC5578SPW/296-27736-5-ND/2360827; VPN: 296-27736-5-ND
U$3 U$6 U$8-U$10 U$12 = openag-transistors:LTV-355T

## Board
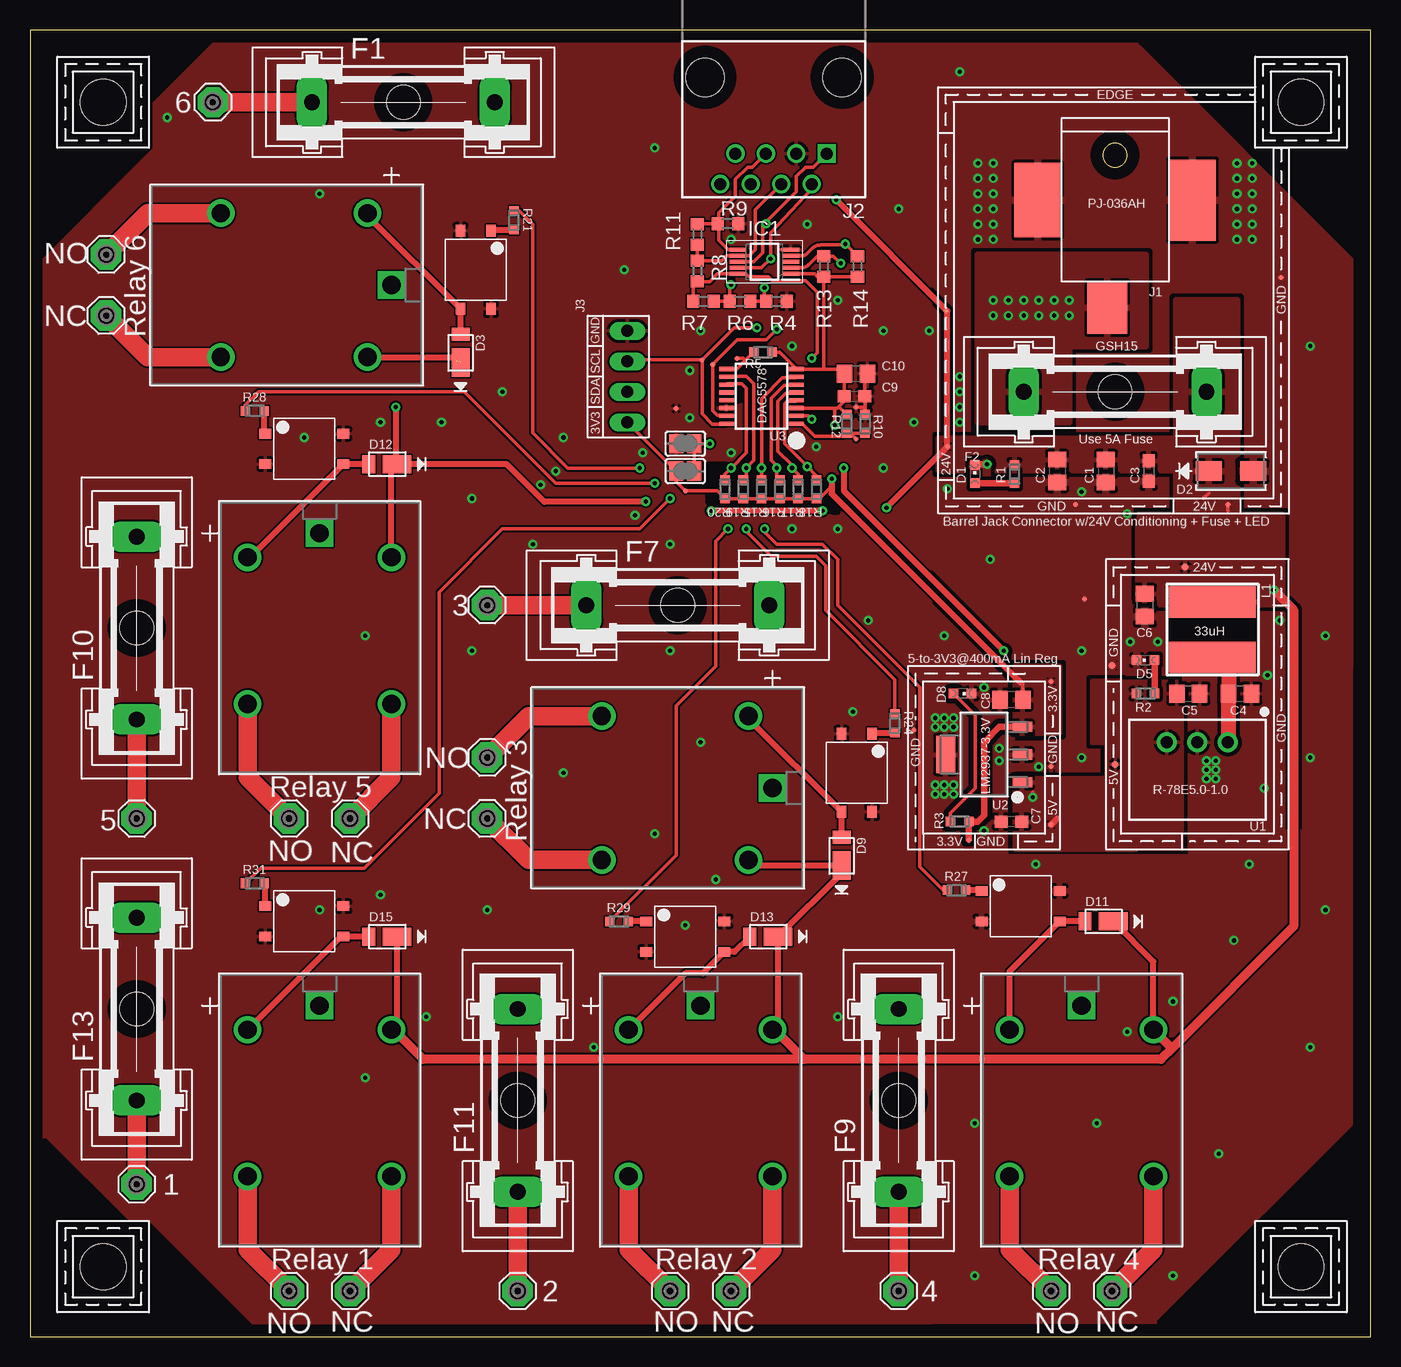
[diagram p2: board, top side]
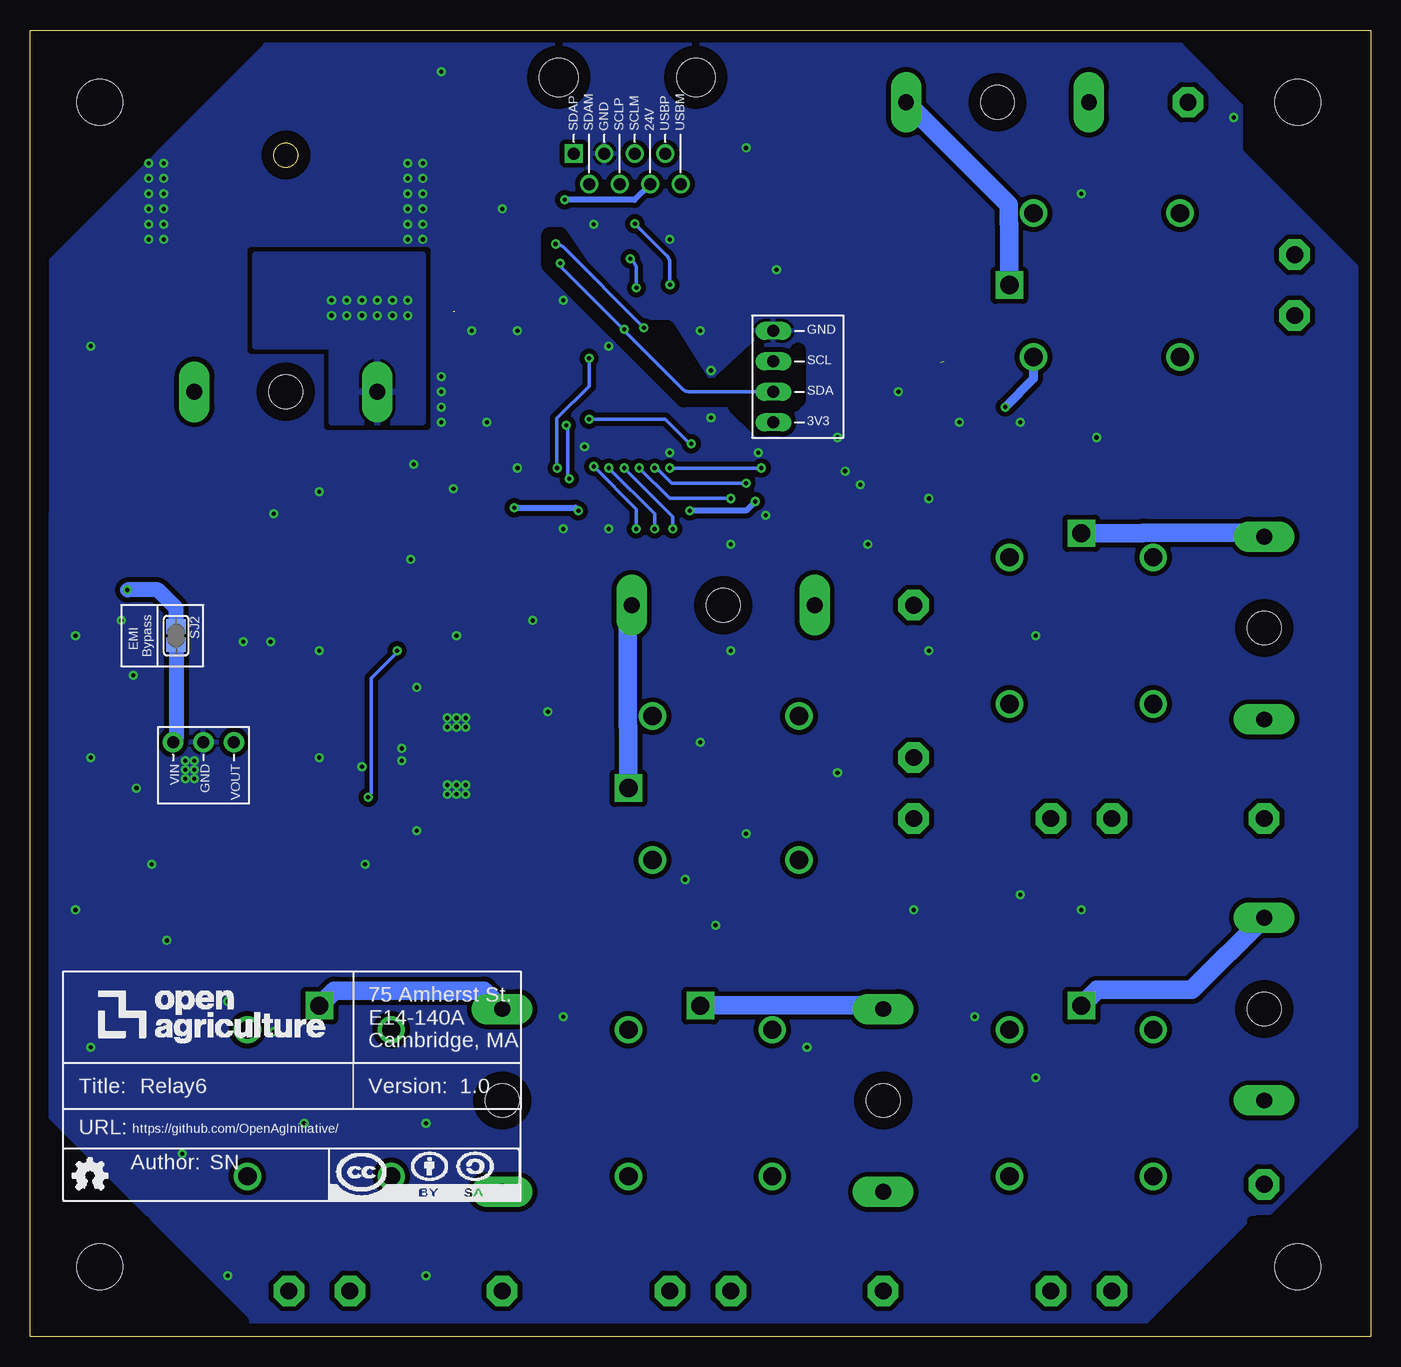
[diagram p3: board, bottom side, seen from below]

Size 111.74 x 108.89 mm. Coordinates in mm from the lower left corner, seen from the top.
Outline: 0,0 111.74,0 111.74,108.89 0,108.89 0,0
Copper layers (1*16): Top 0.035mm / dielectric 1.5mm / Bottom 0.035mm
Design rules "default": minimum track width 6mil, minimum drill 0.35mm, track to track 6mil, track to pad 6mil, pad to pad 6mil, via to via 6mil, smd to smd 6mil, copper to edge 40mil, drill to drill 6mil, minimum pad ring 10mil, minimum via ring 8mil, stop-mask expansion 4mil, vias tented up to drill 0mil, thermal gap 10mil
tRestrict: 16 lines
bRestrict: 23 lines

### Footprints (pad centres in the part's own frame; a part is rotated, then mirrored left to right if it is on the bottom)
C0805 = smd 1.3 x 1.5: 1 -0.95,0; 2 0.95,0
C0603 = smd 1.1 x 1: 1 -0.85,0; 2 0.85,0
CHIPLED_0603 = smd 0.8 x 0.8: A 0,-0.75; C 0,0.75
SMA = smd 2.18 x 1.63: 1 -1.857,0; 2 1.857,0
POWERDI123 = smd 1.05 x 1.5: + -1.3,0 | smd 2.4 x 1.5: - 1.05,0
GSH15 = drill 1.321 pad 2.54 long: 1 -7.62,0; 2 7.62,0 | hole 2.794: 0,0
SOP50P490X110-10N = smd 1.4 x 0.3: 1 -2.2,1; 2 -2.2,0.5; 3 -2.2,0; 4 -2.2,-0.5; 5 -2.2,-1; 6 2.2,-1; 7 2.2,-0.5; 8 2.2,0; 9 2.2,0.5; 10 2.2,1
BARREL-JACK-PJ-036AH = smd 4.4 x 3.3: 1 2.2,-0.65 | smd 6.75 x 3.9: 2 -6.75,6.45 | smd 6.2 x 3.9: 3 -6.75,-6.45
OPENAG-V1-RJ45 = drill 1: 24V(6) 1.905,8.89; DSCLM(5) 0.635,6.35; DSCLP(4) -0.635,8.89; DSDAM(2) -3.175,8.89; GND(3) -1.905,6.35; USBM(8) 4.445,8.89; USBP(7) 3.175,6.35 | drill 1 square: DSDAP(1) -4.445,6.35 | hole 3.2: -5.715,0; 5.715,0
HEADER-I2C = drill 1 long: 3V3 3.81,0.762; GND -3.81,0.762; SCL -1.27,0.762; SDA 1.27,0.762
29333C = smd 2.6 x 7.2: 1 -2.3,0; 2 2.3,0
SE14 = drill 1.397 pad 2.54 octagon: MP 0,0
RC0603N = smd 0.756 x 0.8: 1 -0.778,0; 2 0.778,0
R0603 = smd 1 x 1.1: 1 -0.85,0; 2 0.85,0
RELAY_G5LE-1 = drill 1.524 pad 2.032 square: 1 0,17.424 | drill 1.524 pad 2.032: 2 -5.994,15.418; 3 -5.994,3.2; 4 5.994,3.2; 5 5.994,15.418
EMI-BYPASS = smd 1.168 x 1.6: 1 -0.762,0.254; 2 0.762,0.254
SJ1 = smd 1.168 x 1.6: 1 -0.762,0; 2 0.762,0
TP04R = smd 0.4 x 0.4: 1 0,0
TP06R = smd 0.6 x 0.6: TP 0,0
R-78E5.0-1.0 = drill 1 pad 1.676: 1 -2.54,0; 2 0,0; 3 2.54,0
MP04A = smd 1.6 x 0.838: 1 -3.2,2.3; 2 -3.2,0; 3 -3.2,-2.3 | smd 1.6 x 3.099: 4 3.2,0
TSSOP16 = smd 0.35 x 1.2: 1 -2.275,-2.925; 2 -1.625,-2.925; 3 -0.975,-2.925; 4 -0.325,-2.925; 5 0.325,-2.925; 6 0.975,-2.925; 7 1.625,-2.925; 8 2.275,-2.925; 9 2.275,2.925; 10 1.625,2.925; 11 0.975,2.925; 12 0.325,2.925; 13 -0.325,2.925; 14 -0.975,2.925; 15 -1.625,2.925; 16 -2.275,2.925
CORNER = hole 3.81: 0,0
LTV-355T = smd 0.8 x 1: N1 -1.27,-3.25; N2 1.27,-3.25; N3 -1.27,3.25; N4 1.27,3.25

### Placement (x,y rotation side)
ATTRIBUTES  [DOCFIELD]  108.95,11.32 0 bottom
C1  89.66,72.14 270 top
C2  85.6,72.14 270 top
C3  93.22,72.14 270 top
C4  100.84,53.59 0 top
C5  96.52,53.59 0 top
C6  92.9,60.96 270 top
C7  81.79,42.93 180 top
C8  81.79,53.09 180 top
C9  68.71,78.36 0 top
C10  68.83,80.26 0 top
D1  78.74,71.88 0 top
D2  100.08,72.14 0 top
D3  35.88,82.23 270 top
D5  92.96,56.39 90 top
D8  77.72,53.59 270 top
D9  67.63,40.32 270 top
D11  89.22,34.61 0 top
D12  29.53,72.71 0 top
D13  61.28,33.34 0 top
D15  29.53,33.34 0 top
F1  31.12,102.87 0 top
F2  90.42,78.74 0 top
F4  87.38,74.42 0 top
F7  53.98,60.96 0 top
F9  72.39,19.69 90 top
F10  8.89,59.05 90 top
F11  40.64,19.69 90 top
F13  8.89,27.3 90 top
IC1  61.2,89.58 180 top
J1  90.42,87.96 270 top
J2  61.97,104.95 180 top
J3  49.02,80.01 270 top
L1  98.55,58.93 270 top
LSP4  15.24,102.87 270 top
LSP5  6.35,90.17 270 top
LSP6  6.35,85.09 270 top
LSP13  38.1,60.96 270 top
LSP14  38.1,48.26 270 top
LSP15  38.1,43.18 270 top
LSP19  72.39,3.81 0 top
LSP20  85.09,3.81 0 top
LSP21  90.17,3.81 0 top
LSP22  8.89,43.18 0 top
LSP23  21.59,43.18 0 top
LSP24  26.67,43.18 0 top
LSP25  40.64,3.81 0 top
LSP26  53.34,3.81 0 top
LSP27  58.42,3.81 0 top
LSP31  8.89,12.7 0 top
LSP32  21.59,3.81 0 top
LSP33  26.67,3.81 0 top
R1  82.04,71.88 90 top
R2  92.96,53.59 180 top
R3  77.47,42.93 0 top
R4  62.22,86.28 0 top
R5  61.09,82.04 180 top
R6  59.17,86.28 0 top
R7  56.12,86.28 0 top
R8  55.62,88.82 270 top
R9  58.16,92.75 180 top
R10  69.6,76.07 270 top
R11  55.62,91.86 270 top
R12  68.07,76.07 270 top
R13  66.16,89.2 270 top
R14  68.95,89.2 270 top
R15  60.96,70.61 270 top
R16  62.48,70.61 270 top
R17  64.01,70.61 270 top
R18  65.53,70.61 270 top
R19  59.44,70.61 270 top
R20  57.91,70.61 270 top
R21  40.32,93.03 270 top
R24  72.07,51.12 270 top
R27  77.22,37.21 0 top
R28  18.73,77.15 0 top
R29  49.09,34.61 0 top
R31  18.73,37.78 0 top
RELAY_1  12.7,87.63 270 top
RELAY_5  44.45,45.72 270 top
RELAY_7  87.63,10.16 0 top
RELAY_8  24.13,49.53 0 top
RELAY_9  55.88,10.16 0 top
RELAY_11  24.13,10.16 0 top
SJ2  99.82,58.42 270 bottom
SJ_A1  54.61,72.14 0 top
SJ_A2  54.61,74.42 0 top
TP3  99.82,69.34 0 top
TP4  87.12,69.34 0 top
TP5  104.27,88.27 0 top
TP6  76.45,74.17 0 top
TP7  90.42,47.69 180 top
TP8  96.27,64.13 180 top
TP9  90.17,55.94 180 top
TP10  78.23,41.4 90 top
TP11  85.09,42.67 90 top
TP12  73.66,50.55 90 top
TP13  85.09,54.61 90 top
TP14  85.09,47.5 90 top
TP21  76.33,85.47 270 top
TP22  54.61,70.48 270 top
TP23  68.83,77.47 90 top
TP24  56.9,81.03 270 top
TP25  56.01,81.41 270 top
TP26  68.83,74.8 270 top
TP27  58.93,81.53 270 top
TP28  53.85,77.34 180 top
TP29  87.88,61.47 0 top
U1  97.28,49.53 180 top
U2  79.5,48.51 180 top
U3  60.96,78.36 90 top
U$1  [CORNER]  105.92,102.87 180 top
U$2  [CORNER]  6.1,102.87 270 top
U$3  37.15,88.9 180 top
U$4  [CORNER]  6.1,5.84 0 top
U$5  [CORNER]  105.92,5.84 90 top
U$6  68.9,46.99 180 top
U$8  82.55,35.88 270 top
U$9  22.86,73.98 270 top
U$10  54.61,33.34 270 top
U$12  22.86,34.61 270 top

### Tracks (layer width: path | path; a pad name or v marks a point on that pad's centre or on a via)
24V_EMI
  Top 1.27: U1.1 99.89,49.6 C4.1 99.89,55.29 arc90 L1.2
  Bottom 1.27: SJ2.2 99.57,49.78 U1.1
24V_IN1  (via drill 0.35)
  other vias: 86.61,86.36 86.61,85.09 85.34,86.36 85.34,85.09 84.07,86.36 84.07,85.09 82.8,86.36 81.53,86.36 81.53,85.09 82.8,85.09 80.26,85.09 80.26,86.36
  pour Bottom (isolate 0.406): 86.61,76.2 78.99,76.2 78.99,90.17 92.96,90.17 92.96,82.55 86.61,82.55
  pour Top (isolate 0.406): 78.99,76.2 86.61,76.2 86.61,82.55 92.96,82.55 92.96,90.17 78.99,90.17
!LDAC!
  Top 0.305: U3.1 64.36,76.08 65.41,75.04 67.82,75.04 R12.2 68.58,75.3 | R10.2 68.58,75.3 | TP26.1 68.58,75.06 68.58,75.3
+3V3  (via drill 0.35)
  Top 0.305: IC1.1 65.38,88.58 65.61,88.35 R13.2 | R13.2 R14.2 | R5.1 62.48,82.04 U3.8 66.04,80.63 | 67.41,77.51 R12.1 | 67.41,77.51 67.28,77.38 67.06,77.38 | 67.41,77.51 67.86,77.96 C9.1 67.86,80.24 C10.1 67.51,80.63 66.04,80.63 | U3.3 67.06,77.38 | J3.3V3 SJ_A1.1 53.85,71.25 TP22.1 57.26,70.48 R20.2 R19.2 R15.2 R16.2 R17.2 R18.2 65.77,69.83 66.8,70.87 | R13.2 66.16,80.75 66.04,80.63 | v67.06,75.95 67.06,77.38 | C8.1 82.74,54.42
  Top 0.508: 82.55,54.5 66.8,70.25 66.8,70.87 v66.8,71.5
  Top 0.559: TP10.1 78.23,42.91 R3.2 78.99,42.93 79.5,43.43 79.5,49.53 80.79,50.81 U2.3
  Bottom 0.305: v67.06,75.95 66.93,75.82 66.93,71.63 v66.8,71.5
  pour Top (isolate 0.305): 85.85,55.88 82.04,55.88 82.04,50.29 85.85,50.29
+5V  (via drill 0.35)
  Top 0.305: 83.57,45.35 v83.57,44.96 | 55.66,87.93 56.63,87.93 57.28,88.58 IC1.10 59.64,88.58 59.89,88.32 61.54,88.32 61.85,88.01 64.64,88.01 65.6,87.06 65.6,81.98 v65.15,81.53 | 55.66,87.93 R8.2 | 55.66,87.93 55.27,87.55 R7.1 55.15,86.4
  Top 0.508: v67.82,72.39 67.82,70.48 v81.15,57.15
  Top 0.559: TP11.1 85.6,43.18
  Bottom 0.305: v81.15,57.15 81.15,57.02 83.29,54.89 83.29,45.27 83.57,44.99 v83.57,44.96 | v67.82,72.39 67.84,72.41 67.84,76.53 65.15,79.22 v65.15,81.53
  pour Top (isolate 0.305): 89.66,40.64 89.66,54.61 96.01,54.61 96.01,40.64
  pour Top (isolate 0.406): 90.93,54.61 88.52,54.61 88.52,49.53 90.93,49.53
  pour Top (isolate 0.305): 85.85,40.64 85.85,46.48 82.04,46.48 82.04,40.64
  pour Top (isolate 0.406): 92.2,46.48 84.58,46.48 84.58,40.64 92.2,40.64
+24V  (via drill 0.35)  (2 unrouted)
  Top 0.305: TP3.1 99.82,68.83 | 98.22,70.28 97.79,69.85
  Top 0.508: v67.18,94.74 76.45,85.47 TP6.1 v71.37,69.09 | RELAY_7.5 93.62,31.25 D11.- | RELAY_9.5 62.33,26.03 D13.- 67.63,38.64 D9.- 59.87,39.27 RELAY_5.5 | RELAY_8.5 30.12,72.25 30.48,72.61 | 30.48,72.61 D12.- 39.72,72.71 42.85,69.57 51.29,69.57 v51.31,69.6 | RELAY_1.5 35.2,81.64 35.56,81.28 | D15.- 30.58,26.03 30.21,25.67 RELAY_11.5 | v30.48,77.47 30.48,72.61 | v66.04,68.83 v56.77,68.83
  Top 0.762: v103.63,62.23 103.65,62.23 105.31,60.58 105.31,34.19 95.25,24.13 | 95.25,24.13 94.23,23.11 64.52,23.11 | 64.52,23.11 32.77,23.11 30.21,25.67 | RELAY_9.5 62.05,25.58 64.52,23.11 | RELAY_7.5 95.07,24.13 95.25,24.13
  Bottom 0.508: J2.24V(6) 61.37,94.74 v67.18,94.74 | v71.37,69.09 66.29,69.09 v66.04,68.83 | v56.77,68.83 52.07,68.83 v51.31,69.6
  Bottom 0.762: RELAY_1.5 28.12,79.83 v30.48,77.47
  Bottom 1.27: SJ2.1 99.57,60.71 101.09,62.23 v103.63,62.23
  pour Top (isolate 0.406): 100.58,68.58 100.58,86.36 95.5,86.36 95.5,68.58
  pour Top (isolate 0.406): 96.01,74.93 96.01,72.14 75.69,72.14 75.69,74.93
  pour Top (isolate 0.406): 92.33,60.96 92.33,68.58 104.39,68.58 104.39,60.96
ADDR0  (via drill 0.35)
  Top 0.305: SJ_A1.2 SJ_A2.2 v56.64,74.42 | U3.2 64.87,76.73 v65.15,76.45
  Bottom 0.305: v65.15,76.45 58.8,76.45 56.77,74.42 v56.64,74.42
DAC_!CLR!
  Top 0.305: R5.2 59.62,81.35 | 59.62,81.35 58.9,80.63 U3.9 | TP27.1 59.44,81.53 59.62,81.35
DIM1  (via drill 0.35)
  Top 0.305: R15.1 v60.96,72.39 60.96,78.18 62.7,79.92 63.82,79.92 U3.7 | R31.1 19.23,39.05 27.86,39.05 34.11,45.3 34.11,62.05 39.37,67.31 50.8,67.31 v53.34,69.85
  Bottom 0.305: v60.96,72.39 58.42,69.85 v53.34,69.85
DIM2  (via drill 0.35)
  Top 0.305: R16.1 62.23,71.64 v62.23,72.39 62.23,72.59 61.76,73.06 61.76,78.19 62.84,79.27 63.82,79.27 U3.6 | v58.17,67.31 57.15,66.29 57.15,55.88 53.84,52.57 53.84,40.14 R29.1
  Bottom 0.305: v62.23,72.39 58.17,68.33 v58.17,67.31
DIM3  (via drill 0.35)
  Top 0.305: R17.1 64.01,71.88 v63.5,72.39 63.5,72.62 62.32,73.8 62.32,77.96 62.98,78.61 63.82,78.61 U3.5 | R24.1 72.06,54.75 66.29,60.52 66.29,64.26 65.53,65.02 61.79,65.02 59.69,67.12 v59.69,67.31
  Bottom 0.305: v63.5,72.39 59.69,68.58 v59.69,67.31
DIM4  (via drill 0.35)
  Top 0.305: R18.1 65.53,71.75 v64.77,72.52 62.88,74.41 62.88,77.73 63.12,77.97 63.82,77.97 U3.4 | R27.1 76.12,37.21 74.16,39.16 74.16,54.11 73.66,54.61 67.31,60.96 67.31,64.77 66.04,66.04 62.23,66.04 61.21,67.06 v61.21,67.31
  Bottom 0.305: v64.77,72.52 61.21,68.96 v61.21,67.31
DIM5  (via drill 0.35)
  Top 0.305: R19.1 59.69,71.64 v59.69,72.39 60.32,73.03 60.32,79.42 59.71,80.04 58.09,80.04 U3.10 | v52.07,71.12 43.8,71.12 36.18,78.74 19.05,78.74 17.96,77.64 R28.1
  Bottom 0.305: v59.69,72.39 59.53,72.39 58.26,71.12 v52.07,71.12
DIM6  (via drill 0.35)
  Top 0.305: R20.1 57.91,71.88 v58.42,72.39 59.68,73.65 59.68,79.03 59.31,79.39 58.09,79.39 U3.11 | v50.8,72.39 44.83,72.39 41.91,75.31 41.91,92.71 40.82,93.81 R21.1
  Bottom 0.305: v58.42,72.39 v50.8,72.39
DSCLM1
  Top 0.305: R11.1 55.66,92.75 R9.2 57.39,92.75 | IC1.6 58.17,90.58 57.39,91.36 57.39,92.75 | 57.39,92.75 57.39,93.64 58.79,95.04 58.79,96.44 59.81,97.45 60.19,97.45 J2.DSCLM(5)
DSCLP1
  Top 0.305: R11.2 R8.1 57.63,89.67 58.04,90.08 IC1.7 59.93,90.08 60.44,90.59 60.44,93.9 J2.DSCLP(4)
DSDAM1  (via drill 0.35)
  Top 0.305: J2.DSDAM(2) 65.14,95.67 61.71,91.99 v61.71,89.83 60.95,89.07 59.01,89.07 IC1.9 | R6.2 R4.1 arc-90 61.2,86.44 v61.2,87.42 61.2,87.55
  Bottom 0.305: v61.71,89.83 61.5,89.62 arc45 61.2,88.9 v61.2,87.42
DSDAP1  (via drill 0.35)
  Top 0.305: R7.2 R6.1 58.32,87.58 v58.41,87.67 | 61.33,92.88 61.08,92.63 61.08,90.34 60.32,89.58 IC1.8 | 61.33,92.88 63.87,95.42 63.87,96.69 64.63,97.45 65.27,97.45 J2.DSDAP(1) | v61.33,92.75 61.33,92.88
  Bottom 0.305: v58.41,87.67 58.41,89.41 arc-45 58.71,90.13 v61.33,92.75
GND  (via drill 0.35)
  Top 0.305: R10.1 69.6,77.47 | 69.6,77.47 69.6,78.32 C9.2 69.56,80.04 C10.2 | TP23.1 69.6,77.47 | IC1.5 62.64,90.58
  Top 0.559: D1.C 78.8,72.69 v79.76,72.69
  other vias: 80.26,97.79 80.26,96.52 80.26,95.25 80.26,93.98 80.26,92.71 80.26,91.44 78.99,91.44 78.99,92.71 78.99,93.98 78.99,95.25 78.99,96.52 78.99,97.79 100.58,97.79 100.58,96.52 100.58,95.25 100.58,93.98 100.58,92.71 100.58,91.44 101.85,91.44 101.85,92.71 101.85,93.98 101.85,95.25 101.85,96.52 101.85,97.79 87.63,70.41 76.45,70.66 93.98,57.91 103.12,55.12 98.04,48.01 98.04,47.24 98.81,47.24 98.81,48.01 98.04,46.48 98.81,46.48 91.69,57.91 76.2,45.97 76.96,45.97 76.2,45.21 76.96,45.21 75.44,45.97 75.44,45.21 76.96,50.8 76.96,51.56 76.2,50.8 75.44,50.8 76.2,51.56 75.44,51.56 80.77,48.01 79.5,54.1 80.77,49.02 79.5,42.16 84.07,47.5 87.63,57.15 87.63,48.26 77.47,80.01 77.47,78.74 77.47,77.47 77.47,76.2 72.39,93.98 71.12,83.82 71.12,72.39 65.53,74.17 73.66,76.2 58.42,91.44 64.77,92.71 55.88,83.82 54.99,80.52 63.5,82.55 63.5,67.31 67.31,67.31 78.74,17.78 78.74,5.08 95.25,5.08 99.06,15.24 88.9,17.78 106.68,24.13 107.95,35.56 106.68,48.26 107.95,58.42 101.6,39.37 100.33,33.02 104.14,59.69 49.53,88.9 52.07,99.06 74.93,83.82 36.83,69.85 34.29,76.2 39.37,78.74 44.45,74.93 41.91,66.04 53.34,66.04 24.13,95.25 44.45,46.99 29.21,36.83 24.13,35.56 83.82,39.37 102.87,45.72 80.01,64.77 91.44,68.58 68.58,52.07 69.85,59.69 76.2,58.42 22.86,74.93 29.21,76.2 53.34,57.15 55.88,49.53 54.61,34.29 27.94,58.42 36.83,57.15 52.07,41.91 57.15,38.1 38.1,35.56 46.99,24.13 67.31,26.67 91.44,25.4 95.25,27.94 27.94,21.59 33.02,26.67 77.47,105.41 106.68,82.55 42.55,70.99 43.82,72.14 51.05,73.66 67.31,86.36 58.42,73.66 11.43,101.6 50.42,68.45 54.99,76.58
  pour Top (isolate 0.305, rank 2): 72.52,55.75 72.52,107.57 109.98,107.57 109.98,55.75
  pour Bottom (isolate 0.406, rank 2): 0.76,107.95 109.98,107.95 109.98,68.58 0.76,68.58
  pour Top (isolate 0.305, rank 2): 84.58,40.64 84.58,68.58 110.11,68.58 110.11,40.64
  pour Bottom (isolate 0.406, rank 2): 109.98,1.27 109.98,68.58 0.76,68.58 0.76,1.27
  pour Top (isolate 0.406, rank 3): 73.15,40.64 85.85,40.64 85.85,60.96 73.15,60.96
  pour Bottom (isolate 0.406): 73.15,40.39 73.15,57.15 85.85,57.15 85.85,40.39
  pour Top: 0.76,107.95 75.06,107.95 75.06,0.89 0.76,0.89
  pour Top: 74.93,1.27 74.93,40.64 81.28,40.64 81.28,40 96.77,40 96.77,42.04 109.98,42.04 109.98,1.27
N$1
  Top 0.559: D1.A 78.77,71.1 R1.1
N$3
  Top 0.559: R2.1 93.74,56.36 D5.A
N$5
  Top 0.508: D3.+ U$3.N4 28.12,93.41 RELAY_1.2
N$6
  Top 0.305: D8.A 78.77,51.8 78.77,45.69 76.69,43.62 R3.1
N$7
  Bottom 1.524: RELAY_1.1 30.12,92.72 30.18,92.77 30.18,94.31 F1.2
N$11
  Top 1.524: LSP5.MP 9.8,93.62 RELAY_1.3
N$13
  Top 0.508: U$3.N1 38.52,92.25 R21.2
N$14
  Top 1.524: LSP6.MP 9.8,81.64 RELAY_1.4
N$15
  Top 1.524: F1.1 LSP4.MP
N$28
  Top 0.508: D9.+ U$6.N4 59.87,51.5 RELAY_5.2
N$29
  Bottom 1.524: RELAY_5.1 61.87,50.81 61.93,50.86 61.93,60.63 F7.2
N$30
  Top 1.524: LSP14.MP 41.55,51.71 RELAY_5.3
N$31
  Top 0.508: U$6.N1 70.27,50.34 R24.2
N$32
  Top 1.524: LSP15.MP 41.55,39.73 RELAY_5.4
N$33
  Top 1.524: F7.1 LSP13.MP
N$40
  Top 0.508: D11.+ U$8.N4 81.64,30.44 RELAY_7.2
N$41
  Bottom 1.524: RELAY_7.1 86.39,28.83 73.91,28.83 F9.2
N$42
  Top 1.524: LSP20.MP 81.64,7.26 RELAY_7.3
N$43
  Top 0.508: U$8.N1 79.24,37.21 R27.2
N$44
  Top 1.524: RELAY_7.4 93.62,7.26 LSP21.MP
N$45
  Top 1.524: F9.1 LSP19.MP
N$46
  Top 0.508: D12.+ U$9.N4 18.35,64.95 RELAY_8.2
N$47
  Bottom 1.524: RELAY_8.1 19.04,66.95 18.99,67 9.22,67 F10.2
N$48
  Top 1.524: LSP23.MP 18.14,46.63 RELAY_8.3
N$49
  Top 0.508: U$9.N1 19.51,75.35 R28.2
N$50
  Top 1.524: LSP24.MP 30.12,46.63 RELAY_8.4
N$51
  Top 1.524: F10.1 LSP22.MP
N$52
  Top 0.508: D13.+ 58.71,32.07 U$10.N4 56.08,30.28 54.59,30.28 RELAY_9.2
N$53
  Bottom 1.524: RELAY_9.1 55.88,27.64 40.97,27.64 F11.2
N$54
  Top 1.524: LSP26.MP 49.89,7.26 RELAY_9.3
N$55
  Top 0.508: U$10.N1 R29.2
N$56
  Top 1.524: RELAY_9.4 61.87,7.26 LSP27.MP
N$57
  Top 1.524: F11.1 LSP25.MP
N$64
  Top 0.508: D15.+ U$12.N4 25.9,33.34 RELAY_11.2
N$65
  Bottom 1.524: F13.2 14.91,28.91 22.86,28.91 22.86,28.85 RELAY_11.1
N$66
  Top 1.524: LSP32.MP 18.14,7.26 RELAY_11.3
N$67
  Top 0.508: U$12.N1 19.61,37.68 R31.2
N$68
  Top 1.524: RELAY_11.4 30.12,7.26 LSP33.MP
N$69
  Top 1.524: F13.1 LSP31.MP
SCL  (via drill 0.35)
  Top 0.305: U3.16 57.98,76.03 56.87,76.03 56.01,76.89 TP25.1 | TP25.1 58.67,84.07 v60.58,84.07 | J3.SCL 49.91,81.41 TP25.1 | 67.94,90.97 68.03,90.97 R14.1 | 67.94,90.97 v67.94,91.06 | 67.94,90.97 65.88,90.97 arc45 65.16,90.68 64.71,90.23 arc-45 64.35,90.08 IC1.4
  Bottom 0.305: v60.58,84.07 60.58,84.09 67.26,90.78 arc-45 v67.94,91.06
SDA  (via drill 0.35)  (1 unrouted)
  Top 0.305: U3.15 57.97,76.8 57.27,76.8 56.9,77.17 TP24.1 58.93,83.06 61.34,83.06 v62.23,83.95 | v67.55,89.45 66.96,90.05 R13.1 65.61,90.05 64.94,89.38 arc-45 64.22,89.08 IC1.2
  Bottom 0.305: J3.SDA 56.73,78.74 arc45 57.45,79.04 62.23,83.82 v62.23,83.95 62.3,83.95 67.37,89.02 arc45 v67.55,89.45

### Text on the board
tPlace: EDGE | 6 | Relay 6 | NO | GND | NC | 24V | GND | 24V | Barrel Jack Connector w/24V Conditioning + Fuse + LED | 24V | 3 | GND | 5-to-3V3@400mA Lin Reg | 3.3V | Relay 3 | GND | GND | GND | NO | 5V | Relay 5 | 5V | 5 | NC | 3.3V | GND | NO | NC | 1 | Relay 1 | Relay 2 | Relay 4 | 2 | 4 | NO | NC | NO | NC | NO | NC